# EAGLE design ESP32-Mini1-B (EAGLE 9.6.2)
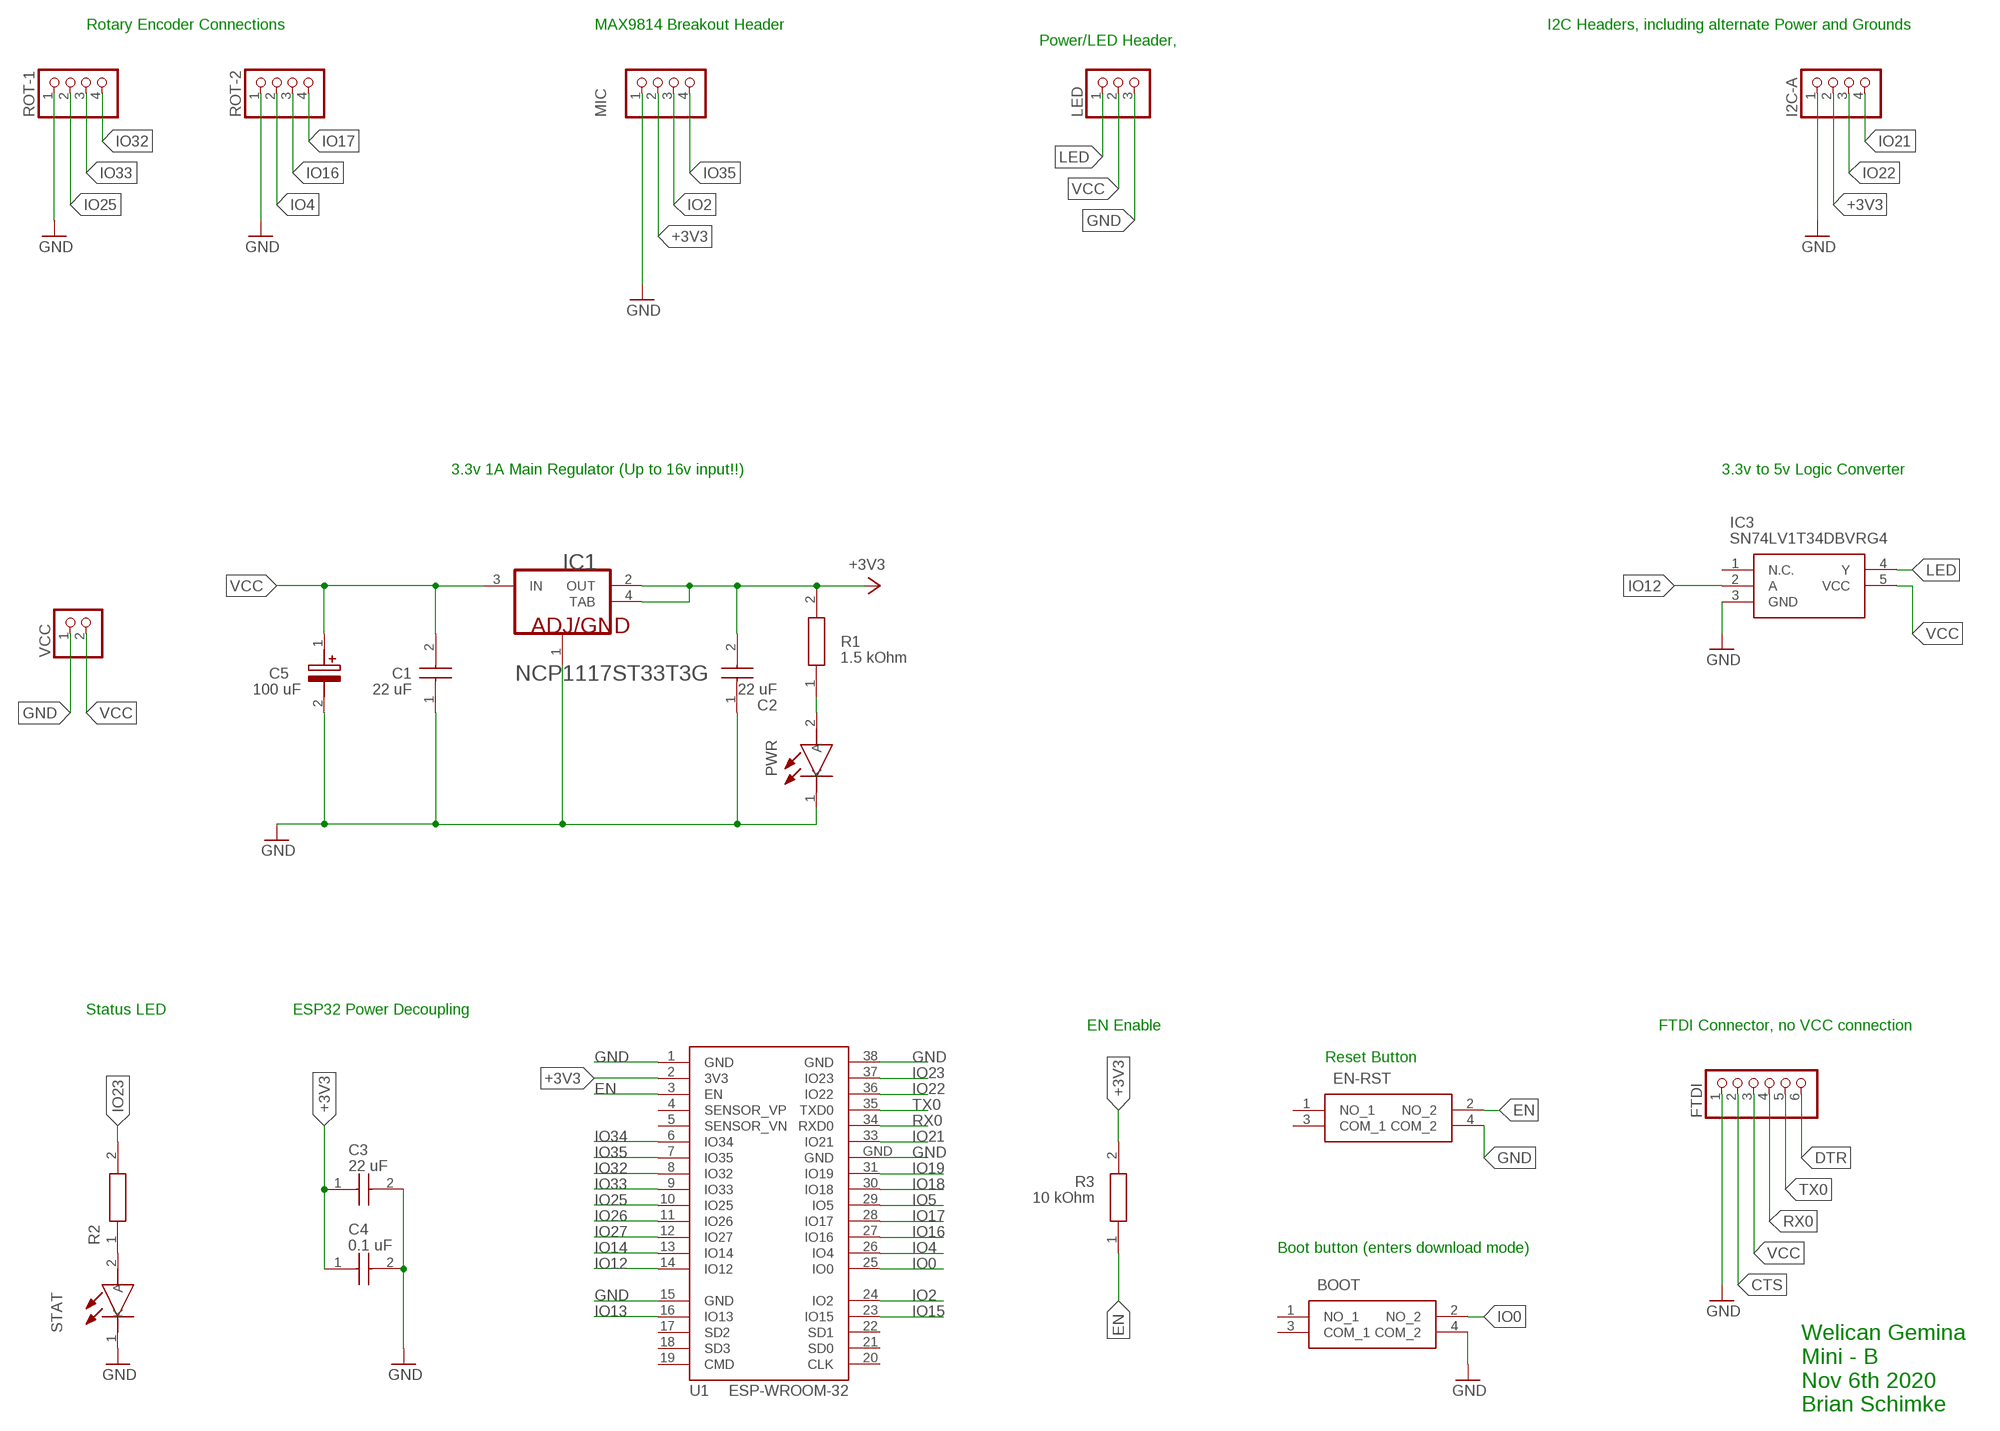
[diagram p0: schematic, sheet 1]

## Parts
BOOT  PTS647SK70SMTR2LFS  [PTS647SK70SMTR2LFS]
C1  22 uF  C1206C226M4PACTU  [CAPC3216X180N]
C2  22 uF  C1206C226M4PACTU  [CAPC3216X180N]
C3  22 uF  C1206C226M4PACTU  [CAPC3216X180N]
C4  0.1 uF  C1206C226M4PACTU  [CAPC3216X180N]
C5  100 uF  865080445010  [CAPAE660X770N]
EN-RST  PTS647SK70SMTR2LFS  [PTS647SK70SMTR2LFS]
FTDI  PINHD-1X6  [1X06]
I2C-A  PINHD-1X4  [1X04]
IC1  ON_SEMICONDUCTOR_NCP1117ST33T3GON_SEMICONDUCTOR_NCP1117ST33T3G_0_0  [ON_SEMICONDUCTOR_NCP1117ST33T3G_0]
IC3  SN74LV1T34DBVRG4  [SOT95P280X145-5N]
LED  PINHD-1X3  [1X03]
MIC  PINHD-1X4  [1X04]
PWR  150120AS75000  [LEDSC320X160X78-2N]
R1  1.5 kOhm  CRCW12061K00FKEB  [RESC3216X60N]
R2  CRCW12061K00FKEB  [RESC3216X60N]
R3  10 kOhm  CRCW12061K00FKEB  [RESC3216X60N]
ROT-1  PINHD-1X4  [1X04]
ROT-2  PINHD-1X4  [1X04]
STAT  150120AS75000  [LEDSC320X160X78-2N]
U1  ESP-WROOM-32  [ESP-WROOM-32]
VCC  PINHD-1X2  [1X02]

## Nets
+3V3: C2.2 C3.1 C4.1 I2C-A.2 IC1.2(OUT) IC1.4(TAB) MIC.2 R1.2 R3.2 U1.2(3V3)
CTS: FTDI.2
DTR: FTDI.6
EN: EN-RST.2(NO_2) R3.1 U1.3(EN)
GND: BOOT.4(COM_2) C1.1 C2.1 C3.2 C4.2 C5.2(-) EN-RST.4(COM_2) FTDI.1 I2C-A.1 IC1.1(ADJ/GND) IC3.3(GND) LED.3 MIC.1 PWR.1(K) ROT-1.1 ROT-2.1 STAT.1(K) U1.1(GND) U1.15(GND) U1.38(GND) U1.GND VCC.1
IO0: BOOT.2(NO_2) U1.25(IO0)
IO2: MIC.3 U1.24(IO2)
IO4: ROT-2.2 U1.26(IO4)
IO5: U1.29(IO5)
IO12: IC3.2(A) U1.14(IO12)
IO13: U1.16(IO13)
IO14: U1.13(IO14)
IO15: U1.23(IO15)
IO16: ROT-2.3 U1.27(IO16)
IO17: ROT-2.4 U1.28(IO17)
IO18: U1.30(IO18)
IO19: U1.31(IO19)
IO21: I2C-A.4 U1.33(IO21)
IO22: I2C-A.3 U1.36(IO22)
IO23: R2.2 U1.37(IO23)
IO25: ROT-1.2 U1.10(IO25)
IO26: U1.11(IO26)
IO27: U1.12(IO27)
IO32: ROT-1.4 U1.8(IO32)
IO33: ROT-1.3 U1.9(IO33)
IO34: U1.6(IO34)
IO35: MIC.4 U1.7(IO35)
LED: IC3.4(Y) LED.1
N$1: PWR.2(A) R1.1
N$2: R2.1 STAT.2(A)
RX0: FTDI.4 U1.34(RXD0)
TX0: FTDI.5 U1.35(TXD0)
VCC: C1.2 C5.1(+) FTDI.3 IC1.3(IN) IC3.5(VCC) LED.2 VCC.2
Unconnected: BOOT.1(NO_1) BOOT.3(COM_1) EN-RST.1(NO_1) EN-RST.3(COM_1) IC3.1(N.C.) U1.4(SENSOR_VP) U1.5(SENSOR_VN) U1.17(SD2) U1.18(SD3) U1.19(CMD) U1.20(CLK) U1.21(SD0) U1.22(SD1)

## Notes on the sheet
- Rotary Encoder Connections | MAX9814 Breakout Header | I2C Headers, including alternate Power and Grounds
- Power/LED Header,
- 3.3v 1A Main Regulator (Up to 16v input!!) | 3.3v to 5v Logic Converter
- Status LED | ESP32 Power Decoupling
- EN Enable | FTDI Connector, no VCC connection
- Reset Button
- Boot button (enters download mode)
- Welican Gemina
  Mini - B
  Nov 6th 2020
  Brian Schimke

## Library data of the parts
BOOT EN-RST = SamacSys_Parts:PTS647SK70SMTR2LFS: Tactile Switches 50mA 12VDC, 2.5N 7.0mm H, G leads Source: Datasheet <https:////www.ckswitches.com/media/2567/pts647.pdf>; DESCRIPTION: Tactile Switches 50mA 12VDC, 2.5N 7.0mm H, G leads; HEIGHT: 7.2mm; MANUFACTURER_NAME: C & K COMPONENTS; MANUFACTURER_PART_NUMBER: PTS647SK70SMTR2LFS; MOUSER_PART_NUMBER: 611-PTS647SK70SMTR2L; MOUSER_PRICE-STOCK: https://www.mouser.co.uk/ProductDetail/CK/PTS647SK70SMTR2LFS?qs=PqoDHHvF64%2FG2CdR6DYUFw%3D%3D
C1-C4 = SamacSys_Parts:C1206C226M4PACTU: KEMET 1206 (3216M) 22uF MLCC 16V dc +/-20% SMD C1206C226M4PACTU Source: Datasheet <https://api.kemet.com/component-edge/download/specsheet/C1206C226M4PACTU.pdf>; DESCRIPTION: KEMET 1206 (3216M) 22uF MLCC 16V dc +/-20% SMD C1206C226M4PACTU; HEIGHT: 1.8mm; MANUFACTURER_NAME: Kemet; MANUFACTURER_PART_NUMBER: C1206C226M4PACTU; MOUSER_PART_NUMBER: 80-C1206C226M4P; MOUSER_PRICE-STOCK: https://www.mouser.co.uk/ProductDetail/KEMET/C1206C226M4PACTU?qs=vBH1GPjCw2UZFSd%252B4IU1Qg%3D%3D
C5 = SamacSys_Parts:865080445010: Wurth Elektronik Aluminium Electrolytic Capacitor 100uF 25V dc 6.3mm V-Chip WCAP-ASLI Series Aluminium, Surface Mount Source: Datasheet <https://katalog.we-online.com/pbs/datasheet/865080445010.pdf>; DESCRIPTION: Wurth Elektronik Aluminium Electrolytic Capacitor 100uF 25V dc 6.3mm V-Chip WCAP-ASLI Series Aluminium, Surface Mount; HEIGHT: 7.7mm; MANUFACTURER_NAME: Wurth Elektronik; MANUFACTURER_PART_NUMBER: 865080445010; MOUSER_PART_NUMBER: 710-865080445010; MOUSER_PRICE-STOCK: https://www.mouser.co.uk/ProductDetail/Wurth-Elektronik/865080445010?qs=0KOYDY2FL29KjsP7WHszFQ%3D%3D
FTDI = pinhead:PINHD-1X6: PIN HEADER
I2C-A MIC ROT-1 ROT-2 = pinhead:PINHD-1X4: PIN HEADER
IC1 = ON Semiconductor - NCP1117ST33T3G:ON_SEMICONDUCTOR_NCP1117ST33T3G: ONSC-NCP1117-SOT223-4; CASE_CODE_IMPERIAL: 0603; CASE_CODE_METRIC: 1608; CASE_PACKAGE: 0603; CIIVA_IDS: 19354120; COMPONENT_LINK_1_DESCRIPTION: Manufacturer URL; COMPONENT_LINK_1_URL: http://www.onsemi.com/; DATASHEET: http://www.onsemi.com/pub_link/Collateral/NCP1117-D.PDF; DATASHEET_VERSION: Rev. 27, 09/2014; FOOTPRINT_VARIANT_NAME_0: Manufacturer Recommended; HEIGHT: 0.45 mm; IMPORTED: yes; IMPORTED_FROM: vault; IMPORT_TS: 1521845423; LENGTH: 1.55 mm; MAX_OPERATING_TEMPERATURE: 155 degC; MF: ON Semiconductor; MIN_OPERATING_TEMPERATURE: -55 degC; MOUNT: Surface Mount; MPN: NCP1117ST33T3G; PACKAGE: SOT-223-4-318H-01_A; PACKAGE_DESCRIPTION: 4-Pin Small Outline Transistor, Body 6.5 x 3.5 mm, Pitch 2.3 mm; PACKAGE_QUANTITY: 5000; PACKAGING: Tape and Reel; POWER_RATING: 100 mW; PREFIX: U; RADIATION_HARDENING: No; REACH_SVHC: Unknown; RELEASE_DATE: 1475065185; RESISTANCE: 220 kohm; RO_HSCOMPLIANT: true; TOLERANCE: 1%; TYPE_RESISTOR: Thick Film; VAULT_GUID: C6E429D0-32F2-4CA3-9C68-29F3FC9DADEB; VAULT_REVISION: 6AD56B9F-4B97-41F2-91E8-97C557B92B31; VOLTAGE_RATING: 75 V; WEIGHT: 7.1E-05 oz; WIDTH: 0.85 mm
IC3 = SamacSys_Parts:SN74LV1T34DBVRG4: Single Power Supply BUFFER Logic Level Shifter (no enable) Source: Datasheet <http://www.ti.com/lit/gpn/sn74lv1t34>; DESCRIPTION: Single Power Supply BUFFER Logic Level Shifter (no enable); HEIGHT: 1.45mm; MANUFACTURER_NAME: Texas Instruments; MANUFACTURER_PART_NUMBER: SN74LV1T34DBVRG4; MOUSER_PART_NUMBER: 595-SN74LV1T34DBVRG4; MOUSER_PRICE-STOCK: https://www.mouser.co.uk/ProductDetail/Texas-Instruments/SN74LV1T34DBVRG4?qs=vdi0iO8H4N10R%252Bt%252BjmxZrg%3D%3D
LED = pinhead:PINHD-1X3: PIN HEADER
PWR STAT = SamacSys_Parts:150120AS75000: WL-SMCW SMD chip LED top view monocolor%D waterclear Source: Datasheet <http://katalog.we-online.com/led/datasheet/150120AS75000.pdf>; DESCRIPTION: WL-SMCW SMD chip LED top view monocolor%D waterclear; HEIGHT: mm; MANUFACTURER_NAME: Wurth Elektronik; MANUFACTURER_PART_NUMBER: 150120AS75000; MOUSER_PART_NUMBER: 710-150120AS75000; MOUSER_PRICE-STOCK: https://www.mouser.co.uk/ProductDetail/Wurth-Elektronik/150120AS75000?qs=LlUlMxKIyB3dthGDbNsiXQ%3D%3D
R1-R3 = SamacSys_Parts:CRCW12061K00FKEB: Thick Film Resistors - SMD 1/4watt 1Kohms 1% Source: Datasheet <http://www.vishay.com/docs/20035/dcrcwe3.pdf>; DESCRIPTION: Thick Film Resistors - SMD 1/4watt 1Kohms 1%; HEIGHT: 0.6mm; MANUFACTURER_NAME: Vishay; MANUFACTURER_PART_NUMBER: CRCW12061K00FKEB; MOUSER_PART_NUMBER: 71-CRCW12061K00FKEB; MOUSER_PRICE-STOCK: https://www.mouser.co.uk/ProductDetail/Vishay-Dale/CRCW12061K00FKEB?qs=3XLFQ9LoC1wOYUVdt2fbOg%3D%3D
U1 = esp32:ESP-WROOM-32: Espressif Systems ESP-WROOM-32
VCC = pinhead:PINHD-1X2: PIN HEADER

## Board
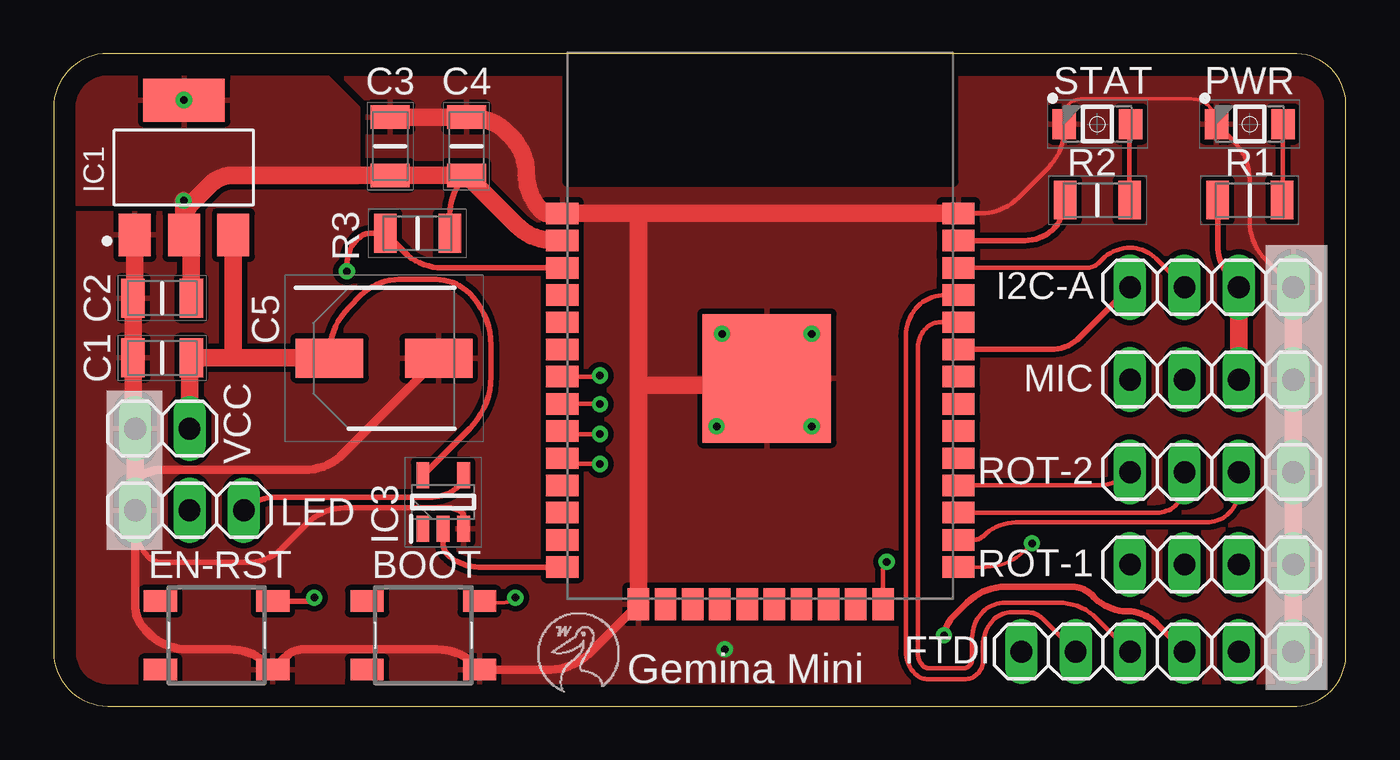
[diagram p1: board, top side]
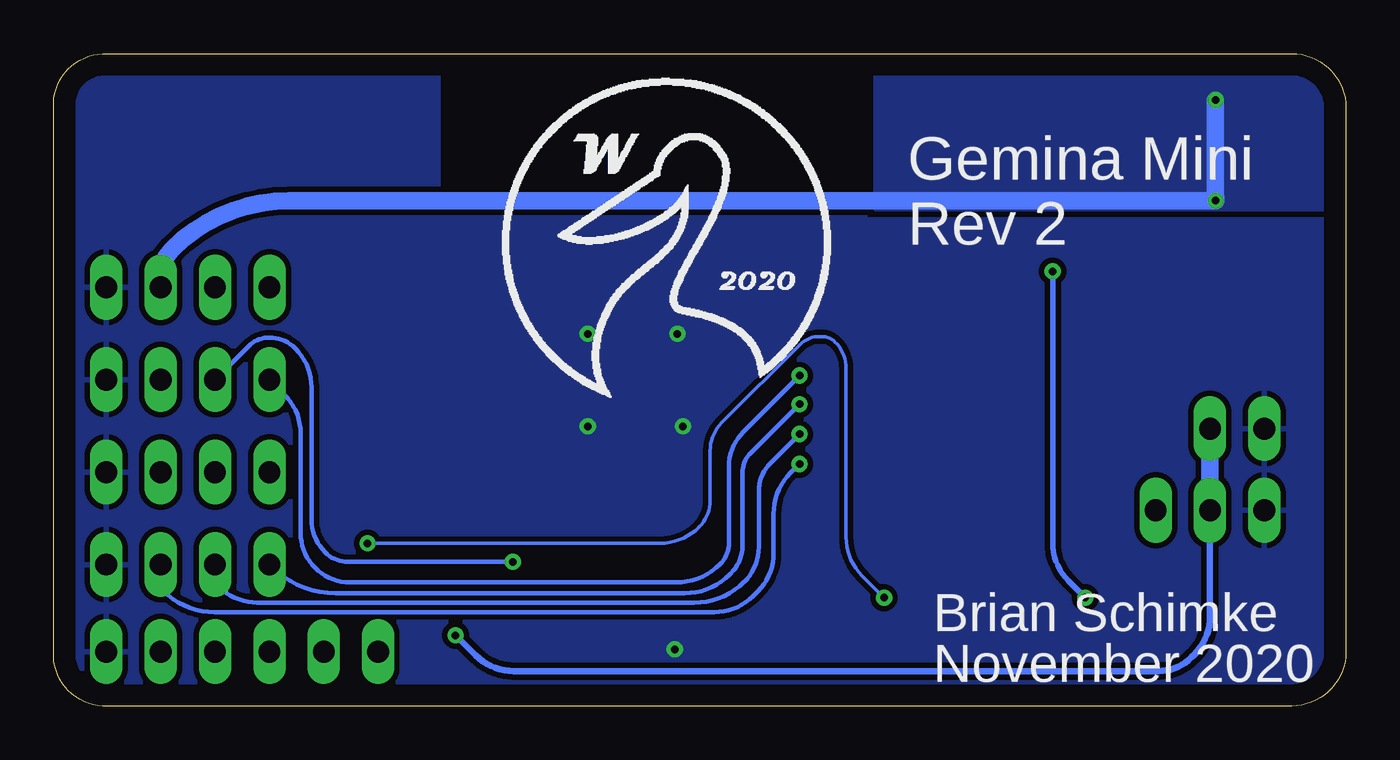
[diagram p2: board, bottom side, seen from below]

Size 60.38 x 30.47 mm. Coordinates in mm from the lower left corner, seen from the top.
Outline: 60.38,2.54 60.38,27.93 arc90 58.09,30.47 2.54,30.47 arc90 0,27.93 0,2.54 arc90 2.54,0 58.09,0 arc90 60.38,2.54
Copper layers (1*16): Top 0.035mm / dielectric 1.5mm / Bottom 0.035mm
Design rules "default": minimum track width 6mil, minimum drill 0.35mm, track to track 6mil, track to pad 6mil, pad to pad 6mil, via to via 6mil, smd to smd 6mil, copper to edge 40mil, drill to drill 6mil, minimum pad ring 10mil, minimum via ring 8mil, stop-mask expansion 4mil, vias tented up to drill 0mil, thermal gap 10mil

### Footprints (pad centres in the part's own frame; a part is rotated, then mirrored left to right if it is on the bottom)
PTS647SK70SMTR2LFS = smd 1.55 x 1: 1 -2.625,1.6; 2 2.625,1.6; 3 -2.625,-1.6; 4 2.625,-1.6
CAPC3216X180N = smd 1.1 x 1.82: 1 -1.36,0; 2 1.36,0
CAPAE660X770N = smd 3.15 x 1.8: 1 -2.55,0; 2 2.55,0
1X06 = drill 1.016 long: 1 -6.35,0; 2 -3.81,0; 3 -1.27,0; 4 1.27,0; 5 3.81,0; 6 6.35,0
1X04 = drill 1.016 long: 1 -3.81,0; 2 -1.27,0; 3 1.27,0; 4 3.81,0
ON_SEMICONDUCTOR_NCP1117ST33T3G_0 = smd 2 x 1.5: 1 -3.15,2.3; 2 -3.15,0; 3 -3.15,-2.3 | smd 2 x 3.8: 4 3.15,0
SOT95P280X145-5N = smd 1.2 x 0.6: 1 -1.25,0.95; 2 -1.25,0; 3 -1.25,-0.95; 4 1.25,-0.95; 5 1.25,0.95
1X03 = drill 1.016 long: 1 -2.54,0; 2 0,0; 3 2.54,0
LEDSC320X160X78-2N = smd 1.1 x 1.4: 1 -1.55,0; 2 1.55,0
RESC3216X60N = smd 1.05 x 1.8: 1 -1.5,0; 2 1.5,0
ESP-WROOM-32 = smd 1.5 x 1: 1 -9.25,7; 2 -9.25,5.73; 3 -9.25,4.46; 4 -9.25,3.19; 5 -9.25,1.92; 6 -9.25,0.65; 7 -9.25,-0.62; 8 -9.25,-1.89; 9 -9.25,-3.16; 10 -9.25,-4.43; 11 -9.25,-5.7; 12 -9.25,-6.97; 13 -9.25,-8.24; 14 -9.25,-9.51; 25 9.25,-9.51; 26 9.25,-8.24; 27 9.25,-6.97; 28 9.25,-5.7; 29 9.25,-4.43; 30 9.25,-3.16; 31 9.25,-1.89; 32 9.25,-0.62; 33 9.25,0.65; 34 9.25,1.92; 35 9.25,3.19; 36 9.25,4.46; 37 9.25,5.73; 38 9.25,7 | smd 1 x 1.5: 15 -5.7,-11.25; 16 -4.43,-11.25; 17 -3.16,-11.25; 18 -1.89,-11.25; 19 -0.62,-11.25; 20 0.65,-11.25; 21 1.92,-11.25; 22 3.19,-11.25; 23 4.46,-11.25; 24 5.73,-11.25 | smd 6 x 6: GND 0.3,-0.7
1X02 = drill 1.016 long: 1 -1.27,0; 2 1.27,0

### Placement (x,y rotation side)
BOOT  17.27,3.3 0 top
C1  5.08,16.26 0 top
C2  5.08,19.05 0 top
C3  15.73,26.14 90 top
C4  19.29,26.14 90 top
C5  15.44,16.24 0 top
EN-RST  7.62,3.3 0 top
FTDI  51.56,2.54 180 top
I2C-A  54.1,19.56 180 top
IC1  6.1,25.15 90 top
IC3  18.2,9.52 90 top
LED  6.35,9.14 180 top
MIC  54.1,15.24 180 top
PWR  55.88,27.18 0 top
R1  55.88,23.62 180 top
R2  48.77,23.62 180 top
R3  17,22.08 0 top
ROT-1  54.1,6.6 180 top
ROT-2  54.1,10.92 180 top
STAT  48.77,27.18 0 top
U1  33.02,16 0 top
VCC  5.08,12.95 0 top

### Tracks (layer width: path | path; a pad name or v marks a point on that pad's centre or on a via)
+3V3  (via drill 0.35)
  Top 0.254: IC1.2 6.3,21.79 6.44,21.65 | R3.2 18.5,22.94 arc-45 19.25,24.74 C4.1 | R1.2 54.38,21.6 arc45 55.12,19.81 I2C-A.2
  Top 0.813: 6.44,21.65 arc90 IC1.2 6.08,22.01 v6.08,23.6 | U1.2 23.39,21.73 arc-45 21.6,22.48 C4.1 C3.1 8.36,24.78 arc45 7.35,24.36 6.44,23.45 arc45 6.08,22.59 6.08,22.32 | 6.08,22.32 arc45 6.3,21.79 | MIC.2 I2C-A.2 | C2.2 6.44,21.46 arc45 6.08,22.32
  Bottom 0.813: I2C-A.2 55.37,20.06 arc45 54.85,21.32 54.83,21.33 arc45 49.36,23.6 v6.08,23.6 arc45 6.08,23.73 6.1,23.76 IC1.4
  other vias: 6.1,28.3
  pour Top: 0.24,30.46 11.67,30.46 14.21,27.92 14.21,24.49 7.61,24.49 6.59,23.48 0.11,23.48 0.11,30.33
  pour Bottom: 0.24,30.21 21.96,30.21 21.96,23.22 0.37,23.22 0.24,23.35
EN  (via drill 0.35)
  Top 0.254: U1.3 18.17,20.46 arc-45 16.38,21.21 R3.1 14.82,22.08 arc45 14.21,21.82 arc45 13.7,20.6 v13.7,20.3 | EN-RST.2 11.8,4.9 arc45 v12.18,5.06
  Bottom 0.254: v12.18,5.06 12.96,5.84 arc45 13.7,7.64 v13.7,20.3
GND  (via drill 0.35)
  Top 0.152: STAT.1 47.22,27.57 arc-90 48,28.35 53.16,28.35 arc-90 PWR.1
  Top 0.203: U1.38 43.29,23 arc45 45.08,23.75 46.47,25.14 arc45 47.22,26.93 STAT.1 | PWR.1 55.14,26.37 arc-45 55.88,24.58 55.88,22.64 arc45 56.62,20.85 I2C-A.1
  Top 0.254: 3.81,16.17 C1.1 | IC3.3 19.15,8.89 arc45 19.11,8.99 arc45 18.48,9.25 13.61,9.25 arc45 11.82,8.51 10.65,7.35 arc-45 9.12,6.71 5.04,6.71 arc-45 4.43,6.97 arc-45 3.81,8.47 3.81,9
  Top 0.406: C5.2 13.52,11.77 arc-45 11.73,11.03 5.04,11.03 arc45 3.81,10.52 | U1.15 25.01,2.45 arc-45 23.22,1.7 19.93,1.7 | 19.93,1.7 BOOT.4 | LED.3 3.81,9 3.81,4.73 arc45 4.3,3.54 4.45,3.39 arc45 6.25,2.65 8.25,2.65 arc-45 10.04,1.9 EN-RST.4 10.83,2.28 arc-45 11.7,2.65 17.93,2.65 arc-45 19.72,1.9 19.93,1.7
  Top 0.813: U1.1 23.73,23 | U1.15 27.32,14.99 | U1.38 27.43,23 | 27.43,23 U1.1 | U1.GND arc-90 33,14.99 27.32,14.99 | 27.32,14.99 27.32,22.89 arc-90 27.43,23 | I2C-A.1 MIC.1 ROT-2.1 ROT-1.1 FTDI.1 | C3.2 C4.2 19.42,27.5 arc-45 21.21,26.76 21.37,26.61 arc-45 22.08,24.87 arc45 22.8,23.14 22.85,23.09 arc45 23.07,23 U1.1 | IC1.1 3.8,19.23 arc-45 C2.1 3.72,16.38 arc45 3.81,16.17 | C1.1 3.72,13.17 arc45 VCC.1 3.81,10.52 LED.3
  other vias: 31.23,17.38 35.42,17.38 35.42,13.06 30.97,13.06 31.36,2.65
  pour Bottom (isolate 0.254): 0.11,22.71 22.47,22.71 22.47,30.46 59.55,30.46 60.31,29.7 60.31,0.74 59.42,-0.15 0.88,-0.15 0.11,0.62
  pour Top (isolate 0.254, rank 5): 1.13,29.83 58.66,29.83 60.31,28.17 60.31,1.38 59.93,1 1.64,1 0.75,1.89 0.75,29.32 0.75,29.44
IO0  (via drill 0.35)
  Top 0.152: BOOT.2 arc-45 19.93,4.82 21,4.82 arc45 v21.58,5.06 | U1.25 43.55,6.49 arc45 45.34,7.24 v45.71,7.6
  Bottom 0.152: v45.71,7.6 32.03,7.6 arc-45 30.23,8.34 30.21,8.36 arc-45 29.7,9.59 29.7,11.92 arc45 29.17,13.22 25.49,16.89 arc45 24.62,17.25 24.48,17.25 arc45 23.86,17 arc45 23.35,15.77 23.35,7.89 arc-45 22.61,6.09 v21.58,5.06
IO2  (via drill 0.35)
  Top 0.203: U1.24 38.75,6.31 arc-45 v38.93,6.73
  Bottom 0.203: MIC.3 51.27,16.8 arc45 50.29,17.21 arc45 49.1,16.71 49.07,16.68 arc45 48.32,14.89 48.32,8.71 arc-45 47.69,7.18 arc-45 46.62,6.73 v38.93,6.73
IO4
  Top 0.203: ROT-2.2 55.37,10.09 arc-45 54.93,9.02 arc-45 53.85,8.57 44.97,8.57 arc45 43.43,7.94 arc-45 43.01,7.76 U1.26
IO12
  Top 0.254: U1.14 19.85,6.49 arc-45 18.4,7.09 arc-45 18.2,7.57 IC3.2
IO16
  Top 0.203: U1.27 51.57,9.03 arc45 52.45,9.4 arc45 52.83,10.32 ROT-2.3
IO17
  Top 0.203: U1.28 48.79,10.3 arc45 ROT-2.4
IO21
  Top 0.254: U1.33 46.59,16.65 arc45 47.95,17.22 I2C-A.4
IO22
  Top 0.203: I2C-A.3 51.48,20.91 arc45 50.29,21.4 arc45 48.99,20.86 48.83,20.7 arc-45 48.25,20.46 U1.36
IO23
  Top 0.254: U1.37 45.38,21.73 arc90 R2.2
IO25  (via drill 0.35)
  Top 0.203: U1.10 arc45 24.42,11.3 v25.53,11.3
  Bottom 0.203: 55.37,5.69 arc-45 55.24,5.37 arc-45 52.86,4.38 29.5,4.38 arc-45 27.7,5.13 27.48,5.35 arc-45 26.73,7.15 26.73,8.98 arc45 25.94,10.89 v25.53,11.3
  Bottom 0.254: 55.37,5.69 ROT-1.2
IO32  (via drill 0.35)
  Top 0.203: U1.8 25.49,14.11 arc45 v25.53,14.1
  Bottom 0.203: v25.53,14.1 27.81,11.82 arc-45 28.19,10.89 28.19,7.49 arc45 28.73,6.19 28.79,6.13 arc45 30.87,5.27 47.2,5.27 arc45 50.2,6.52 ROT-1.4
IO33  (via drill 0.35)
  Top 0.203: v25.53,12.7 24.11,12.7 arc-45 U1.9
  Bottom 0.203: 52.62,5.56 arc-45 50.86,4.83 30.45,4.83 arc-45 28.11,5.79 28.1,5.81 arc-45 27.43,7.42 27.43,10.03 arc45 26.89,11.33 v25.53,12.7
  Bottom 0.254: 52.62,5.56 arc45 52.83,6.06 ROT-1.3
IO35  (via drill 0.35)
  Top 0.203: U1.7 25.41,15.38 arc45 v25.53,15.43
  Bottom 0.203: v25.53,15.43 28.16,12.8 arc-45 28.83,11.18 28.83,7.62 arc45 29.24,6.62 arc45 31.28,5.78 46.54,5.78 arc45 48.15,6.45 arc45 48.83,8.08 48.83,12.73 arc-45 49.58,14.52 MIC.4
LED
  Top 0.254: LED.1 arc-45 10.37,9.76 17.68,9.76 arc45 18.91,10.27 18.97,10.32 arc45 IC3.4
N$1
  Top 0.203: PWR.2 57.43,23.74 arc-45 R1.1
N$2
  Top 0.203: STAT.2 arc45 50.27,27.06 R2.1
RX0
  Top 0.203: U1.34 41.42,17.92 arc45 40.77,17.65 arc45 40.39,16.73 40.39,2.41 arc45 40.6,1.9 arc45 40.93,1.76 42.48,1.76 arc45 42.79,1.89 arc45 42.91,2.19 42.91,3.18 arc-45 43.42,4.4 arc-45 44.44,4.83 46.95,4.83 arc-45 48.75,4.08 FTDI.4
TX0
  Top 0.203: FTDI.5 46.22,4.07 arc45 45.47,4.38 44.74,4.38 arc45 43.93,4.04 arc45 43.42,2.82 43.42,2.12 arc-45 43.17,1.5 arc-45 42.55,1.25 40.86,1.25 arc-45 40.25,1.5 arc-45 39.81,2.55 39.81,17.29 arc-45 40.39,18.67 arc-45 41.65,19.19 U1.35
VCC  (via drill 0.35)
  Top 0.254: IC3.5 19.44,12.96 arc45 20.43,15.37 20.43,16.86 arc45 19.44,19.27 19.43,19.27 arc45 17.86,19.92 16.15,19.92 arc45 14.36,19.18 13.8,18.62 arc45 12.89,16.43 C5.1
  Top 0.305: FTDI.3 51.51,3.86 arc45 50.15,4.43 arc-45 48.63,5.05 48.5,5.19 arc45 47.58,5.57 44.47,5.57 arc45 42.68,4.82 42,4.15 arc45 41.64,3.28 arc-45 v41.6,3.3
  Top 0.813: 6.44,13.04 arc-90 VCC.2 6.35,16.04 arc-45 C1.2 8.37,16.26 | 8.37,16.26 12.85,16.26 arc-45 C5.1 | IC1.3 8.4,16.32 arc-45 8.37,16.26
  Bottom 0.305: v41.6,3.3 40.67,2.38 arc-45 38.88,1.63 8.76,1.63 arc-45 7.23,2.27 7.09,2.4 arc-45 6.35,4.19 LED.2
  Bottom 0.813: LED.2 VCC.2

### Text on the board
tPlace: Gemina Mini
bPlace: Gemina Mini / Rev 2 | Brian Schimke | November 2020